# Altium project EVB-NORA-B2.PrjPcb (part 1 of 2)
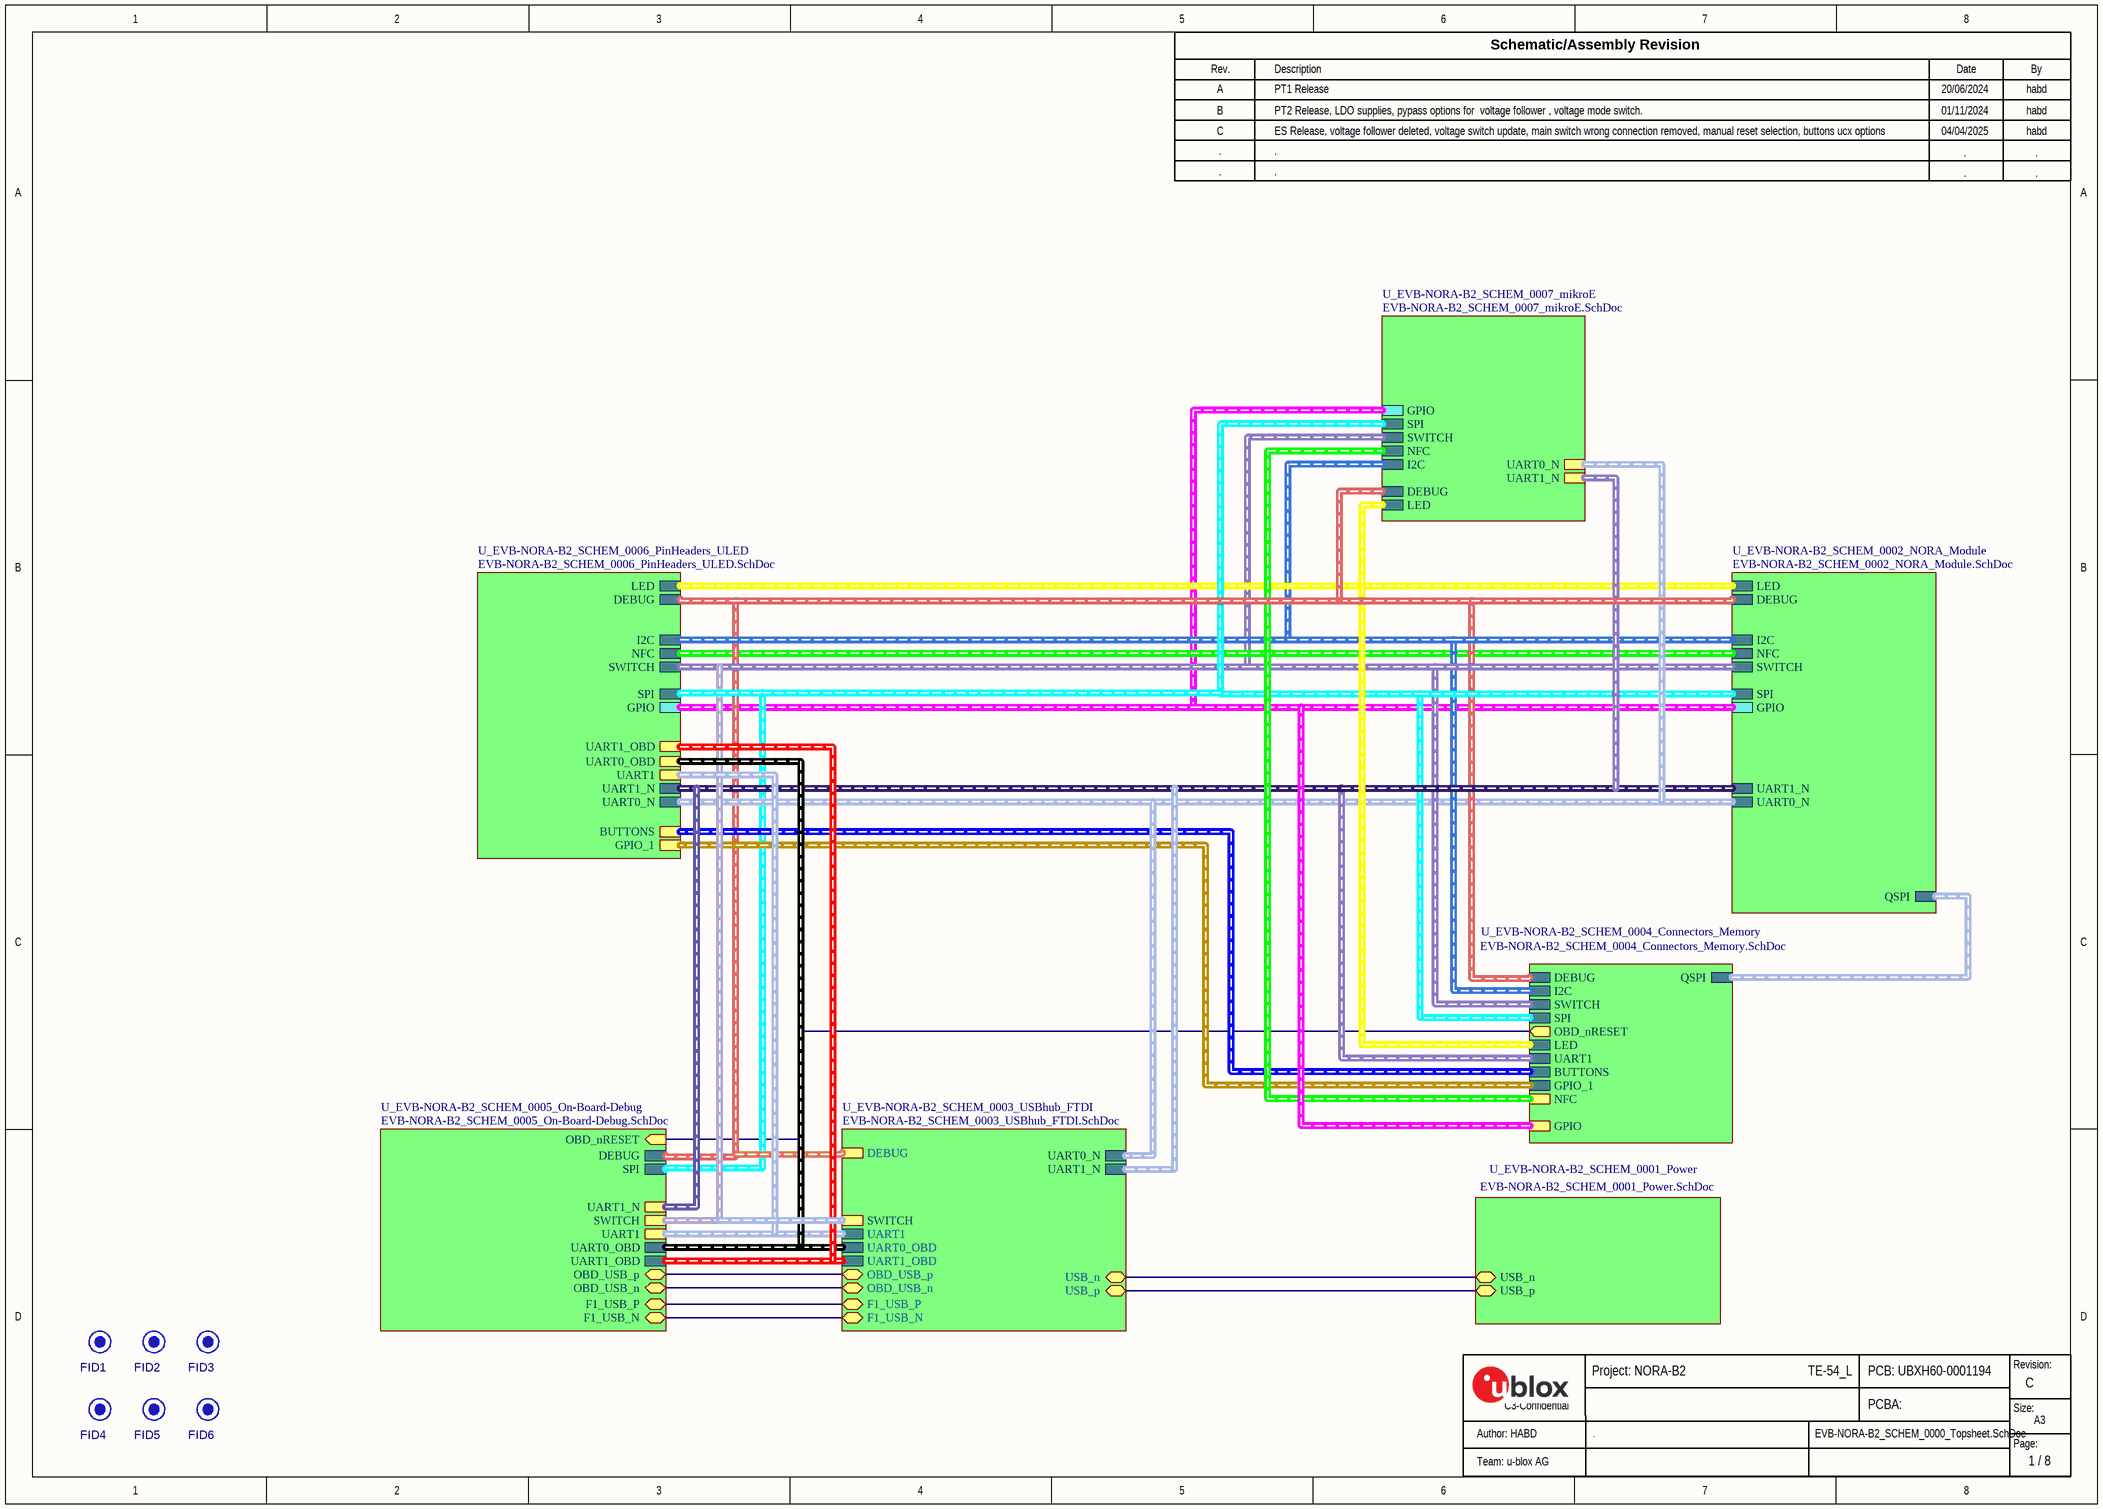
[diagram p0: EVB-NORA-B2_SCHEM_0000_Topsheet.SchDoc]
GlobalClientName: u-blox; GlobalProjectCode: TE-54_L; GlobalProjectLink: www.u-blox.com; GlobalProjectName: NORA-B2; GlobalProjectRevision: Rev C; GlobalProjectTeam: u-blox AG; GlobalReleaseDate: 04/04/2025; PCBConfidentialGrade: C3-Confidential; PCBDocNum: UBXH60-0001194; PCBName: EVK-NORA-B20; PCBRevRelease1: A; PCBRevReleaseBy1: habd; PCBRevReleaseBy2: habd; PCBRevReleaseBy3: habd; PCBRevReleaseBy4: -; PCBRevReleaseBy5: -; PCBRevReleaseDate1: 20/06/2024; PCBRevReleaseDate2: 01/11/2024; PCBRevReleaseDate3: 04/04/2025; PCBRevReleaseDate4: -; PCBRevReleaseDate5: -; PCBRevReleaseDesc1: PT1 Release; PCBRevReleaseDesc2: PT2 Release; PCBRevReleaseDesc3: ES Release; PCBRevReleaseDesc4: -; PCBRevReleaseDesc5: -; PCBRevReleaseRev1: A; PCBRevReleaseRev2: B; PCBRevReleaseRev3: C; PCBRevReleaseRev4: -; PCBRevReleaseRev5: -; PCBUBXNum: UBXH60-0001194; ProjectEngineer: HABD; ReleaseBy4: .; ReleaseBy4: .; ReleaseBy5: .; ReleaseBy5: .; ReleaseDate4: .; ReleaseDate5: .; ReleaseDesc4: .; ReleaseDesc5: .; ReleaseRev1: A; ReleaseRev2: B; ReleaseRev3: C; ReleaseRev4: .; ReleaseRev5: .; SchDocNum: EVK-NORA-B20_SCHEM; SchSheetTotal: 8; SheetSize: A3; VariantBy1: habd; VariantBy2: habd; VariantBy3: habd; VariantBy4: .; VariantBy5: .; VariantDate1: 20/06/2024; VariantDate2: 01/11/2024; VariantDate3: 04/04/2025; VariantDate4: .; VariantDate5: .; VariantDesc1: PT1 Release; VariantDesc2: PT2 Release, LDO supplies, pypass options for  voltage follower , voltage mode switch.; VariantDesc3: ES Release, voltage follower deleted, voltage switch update, main switch wrong connection removed, manual reset selection, buttons ucx options; VariantDesc4: .; VariantDesc5: .; VariantDescription: .; VariantRev: C; VariantRev1: A; VariantRev2: B; VariantRev3: C; VariantRev4: .; VariantRev5: .
4 sheets, 254 parts. Net scope: flat (ports and power ports of the same name join across sheets).
Board file: EVB-NORA-B20.PcbDoc
Sheets:
  EVB-NORA-B2_SCHEM_0000_Topsheet.SchDoc
    U_EVB-NORA-B2_SCHEM_0001_Power = EVB-NORA-B2_SCHEM_0001_Power.SchDoc
    U_EVB-NORA-B2_SCHEM_0002_NORA_Module = EVB-NORA-B2_SCHEM_0002_NORA_Module.SchDoc
    U_EVB-NORA-B2_SCHEM_0006_PinHeaders_ULED = EVB-NORA-B2_SCHEM_0006_PinHeaders_ULED.SchDoc

## Sheet EVB-NORA-B2_SCHEM_0000_Topsheet.SchDoc
size A3; Date: 7/24/2020; CompanyName: U-Blox; DrawnBy: EMOO; Engineer: EMOO; Organization: U-Blox; Address1: 3950 Fairview Industrial Dr SE #100; Address2: Salem, OR 97302; DocumentNumber: 1; SheetNumber: 1; SheetTotal: 8; SheetSize: B; SheetTitle: TopSheet

### Parts
FID1  FID  [FIDUCIAL40]  (value not drawn)  (no BOM)
FID2  FID  [FIDUCIAL40]  (value not drawn)  (no BOM)
FID3  FID  [FIDUCIAL40]  (value not drawn)  (no BOM)
FID4  FID  [FIDUCIAL40]  (value not drawn)  (no BOM)
FID5  FID  [FIDUCIAL40]  (value not drawn)  (no BOM)
FID6  FID  [FIDUCIAL40]  (value not drawn)  (no BOM)

### Sub-sheets
U_EVB-NORA-B2_SCHEM_0001_Power = EVB-NORA-B2_SCHEM_0001_Power.SchDoc: USB_n (bidir), USB_p (bidir)
U_EVB-NORA-B2_SCHEM_0002_NORA_Module = EVB-NORA-B2_SCHEM_0002_NORA_Module.SchDoc: LED (harness LED), DEBUG (harness Debug), UART1_N (harness UART1), I2C (harness I2C), NFC (harness NFC), SWITCH (harness SWITCH), UART0_N (harness UART0), QSPI (harness QSPI), SPI (harness SPI), GPIO (harness GPIO)
U_EVB-NORA-B2_SCHEM_0003_USBhub_FTDI = EVB-NORA-B2_SCHEM_0003_USBhub_FTDI.SchDoc (file not in this document): USB_n (bidir), USB_p (bidir), F1_USB_P (bidir), F1_USB_N (bidir), UART1 (harness UART-EXT), UART0_N (harness UART0), UART1_N (harness UART1), UART0_OBD (harness UART0_OBD), UART1_OBD (harness UART1_OBD), DEBUG (harness Debug), OBD_USB_n (bidir), OBD_USB_p (bidir), SWITCH (harness SWITCH)
U_EVB-NORA-B2_SCHEM_0004_Connectors_Memory = EVB-NORA-B2_SCHEM_0004_Connectors_Memory.SchDoc (file not in this document): DEBUG (harness Debug), I2C (harness I2C), SWITCH (harness SWITCH), QSPI (harness QSPI), SPI (harness SPI), LED (harness LED), UART1 (harness UART1), BUTTONS (harness BUTTONS), GPIO_1 (harness GP1O_1), OBD_nRESET (out), NFC (harness NFC), GPIO (harness GPIO)
U_EVB-NORA-B2_SCHEM_0005_On-Board-Debug = EVB-NORA-B2_SCHEM_0005_On-Board-Debug.SchDoc (file not in this document): F1_USB_P (bidir), F1_USB_N (bidir), UART0_OBD (harness UART0_OBD), UART1_OBD (harness UART1_OBD), DEBUG (harness Debug), SPI (harness SPI), OBD_nRESET (in), OBD_USB_p (bidir), OBD_USB_n (bidir), UART1 (harness UART1), SWITCH (harness SWITCH), UART1_N (harness UART1-NORA)
U_EVB-NORA-B2_SCHEM_0006_PinHeaders_ULED = EVB-NORA-B2_SCHEM_0006_PinHeaders_ULED.SchDoc: I2C (harness I2C), LED (harness LED), SWITCH (harness SWITCH), NFC (harness NFC), SPI (harness SPI), GPIO (harness GPIO), DEBUG (harness Debug), UART0_N (harness UART0), UART1_N (harness UART1), BUTTONS (harness BUTTONS), GPIO_1 (harness GP1O_1), UART1 (harness UART1), UART0_OBD (harness UART0_OBD), UART1_OBD (harness UART1_OBD)
U_EVB-NORA-B2_SCHEM_0007_mikroE = EVB-NORA-B2_SCHEM_0007_mikroE.SchDoc (file not in this document): I2C (harness I2C), LED (harness LED), SWITCH (harness SWITCH), NFC (harness NFC), DEBUG (harness Debug), SPI (harness SPI), GPIO (harness GPIO), UART0_N (harness UART0_NORA), UART1_N (harness UART1-NORA)

### Nets
(unnamed): sheet U_EVB-NORA-B2_SCHEM_0001_Power/USB_n, sheet U_EVB-NORA-B2_SCHEM_0003_USBhub_FTDI/USB_n
(unnamed): sheet U_EVB-NORA-B2_SCHEM_0001_Power/USB_p, sheet U_EVB-NORA-B2_SCHEM_0003_USBhub_FTDI/USB_p
(unnamed): sheet U_EVB-NORA-B2_SCHEM_0003_USBhub_FTDI/F1_USB_P, sheet U_EVB-NORA-B2_SCHEM_0005_On-Board-Debug/F1_USB_P
(unnamed): sheet U_EVB-NORA-B2_SCHEM_0003_USBhub_FTDI/F1_USB_N, sheet U_EVB-NORA-B2_SCHEM_0005_On-Board-Debug/F1_USB_N
(unnamed): sheet U_EVB-NORA-B2_SCHEM_0003_USBhub_FTDI/OBD_USB_n, sheet U_EVB-NORA-B2_SCHEM_0005_On-Board-Debug/OBD_USB_n
(unnamed): sheet U_EVB-NORA-B2_SCHEM_0003_USBhub_FTDI/OBD_USB_p, sheet U_EVB-NORA-B2_SCHEM_0005_On-Board-Debug/OBD_USB_p
(unnamed): sheet U_EVB-NORA-B2_SCHEM_0005_On-Board-Debug/OBD_nRESET, sheet U_EVB-NORA-B2_SCHEM_0004_Connectors_Memory/OBD_nRESET

### Buses and harness runs
harness sheet U_EVB-NORA-B2_SCHEM_0002_NORA_Module/DEBUG = sheet U_EVB-NORA-B2_SCHEM_0003_USBhub_FTDI/DEBUG = sheet U_EVB-NORA-B2_SCHEM_0004_Connectors_Memory/DEBUG = sheet U_EVB-NORA-B2_SCHEM_0005_On-Board-Debug/DEBUG = sheet U_EVB-NORA-B2_SCHEM_0006_PinHeaders_ULED/DEBUG = sheet U_EVB-NORA-B2_SCHEM_0007_mikroE/DEBUG
harness sheet U_EVB-NORA-B2_SCHEM_0002_NORA_Module/GPIO = sheet U_EVB-NORA-B2_SCHEM_0004_Connectors_Memory/GPIO = sheet U_EVB-NORA-B2_SCHEM_0006_PinHeaders_ULED/GPIO = sheet U_EVB-NORA-B2_SCHEM_0007_mikroE/GPIO
harness sheet U_EVB-NORA-B2_SCHEM_0002_NORA_Module/I2C = sheet U_EVB-NORA-B2_SCHEM_0004_Connectors_Memory/I2C = sheet U_EVB-NORA-B2_SCHEM_0006_PinHeaders_ULED/I2C = sheet U_EVB-NORA-B2_SCHEM_0007_mikroE/I2C
harness sheet U_EVB-NORA-B2_SCHEM_0002_NORA_Module/LED = sheet U_EVB-NORA-B2_SCHEM_0006_PinHeaders_ULED/LED
harness sheet U_EVB-NORA-B2_SCHEM_0002_NORA_Module/NFC = sheet U_EVB-NORA-B2_SCHEM_0006_PinHeaders_ULED/NFC
harness sheet U_EVB-NORA-B2_SCHEM_0002_NORA_Module/QSPI = sheet U_EVB-NORA-B2_SCHEM_0004_Connectors_Memory/QSPI
harness sheet U_EVB-NORA-B2_SCHEM_0002_NORA_Module/SPI = sheet U_EVB-NORA-B2_SCHEM_0004_Connectors_Memory/SPI = sheet U_EVB-NORA-B2_SCHEM_0005_On-Board-Debug/SPI = sheet U_EVB-NORA-B2_SCHEM_0006_PinHeaders_ULED/SPI = sheet U_EVB-NORA-B2_SCHEM_0007_mikroE/SPI
harness sheet U_EVB-NORA-B2_SCHEM_0002_NORA_Module/SWITCH = sheet U_EVB-NORA-B2_SCHEM_0003_USBhub_FTDI/SWITCH = sheet U_EVB-NORA-B2_SCHEM_0004_Connectors_Memory/SWITCH = sheet U_EVB-NORA-B2_SCHEM_0005_On-Board-Debug/SWITCH = sheet U_EVB-NORA-B2_SCHEM_0006_PinHeaders_ULED/SWITCH = sheet U_EVB-NORA-B2_SCHEM_0007_mikroE/SWITCH
harness sheet U_EVB-NORA-B2_SCHEM_0002_NORA_Module/UART0_N = sheet U_EVB-NORA-B2_SCHEM_0003_USBhub_FTDI/UART0_N = sheet U_EVB-NORA-B2_SCHEM_0006_PinHeaders_ULED/UART0_N = sheet U_EVB-NORA-B2_SCHEM_0007_mikroE/UART0_N
harness sheet U_EVB-NORA-B2_SCHEM_0002_NORA_Module/UART1_N = sheet U_EVB-NORA-B2_SCHEM_0003_USBhub_FTDI/UART1_N = sheet U_EVB-NORA-B2_SCHEM_0004_Connectors_Memory/UART1 = sheet U_EVB-NORA-B2_SCHEM_0005_On-Board-Debug/UART1_N = sheet U_EVB-NORA-B2_SCHEM_0006_PinHeaders_ULED/UART1_N = sheet U_EVB-NORA-B2_SCHEM_0007_mikroE/UART1_N
harness sheet U_EVB-NORA-B2_SCHEM_0003_USBhub_FTDI/UART0_OBD = sheet U_EVB-NORA-B2_SCHEM_0005_On-Board-Debug/UART0_OBD = sheet U_EVB-NORA-B2_SCHEM_0006_PinHeaders_ULED/UART0_OBD
harness sheet U_EVB-NORA-B2_SCHEM_0003_USBhub_FTDI/UART1 = sheet U_EVB-NORA-B2_SCHEM_0005_On-Board-Debug/UART1 = sheet U_EVB-NORA-B2_SCHEM_0006_PinHeaders_ULED/UART1
harness sheet U_EVB-NORA-B2_SCHEM_0003_USBhub_FTDI/UART1_OBD = sheet U_EVB-NORA-B2_SCHEM_0005_On-Board-Debug/UART1_OBD = sheet U_EVB-NORA-B2_SCHEM_0006_PinHeaders_ULED/UART1_OBD
harness sheet U_EVB-NORA-B2_SCHEM_0004_Connectors_Memory/BUTTONS = sheet U_EVB-NORA-B2_SCHEM_0006_PinHeaders_ULED/BUTTONS
harness sheet U_EVB-NORA-B2_SCHEM_0004_Connectors_Memory/GPIO_1 = sheet U_EVB-NORA-B2_SCHEM_0006_PinHeaders_ULED/GPIO_1
harness sheet U_EVB-NORA-B2_SCHEM_0004_Connectors_Memory/LED = sheet U_EVB-NORA-B2_SCHEM_0007_mikroE/LED
harness sheet U_EVB-NORA-B2_SCHEM_0004_Connectors_Memory/NFC = sheet U_EVB-NORA-B2_SCHEM_0007_mikroE/NFC

### Notes on the sheet
- Rev.
- Description
- Schematic/Assembly Revision
- Date
- By
- Revision:
- C3-Confidential
- Page:
- Size:
- A3

### Library data of the parts
FID1-FID6 = FIDUCIAL.04: Fiducial, 0.040" inner Dia, 0.075" outer Dia; Added By: Jeremy D; Part Number: FIDUCIAL.04; Size: 0.040"; Height: 0; DNP: DNP; Added Date: 2/1/2015; Checked By: Paul B; Checked Date: 2/5/2015

## Sheet EVB-NORA-B2_SCHEM_0001_Power.SchDoc
size A3; Date: 7/24/2020; CompanyName: U-blox; DrawnBy: EMOO; Engineer: EMOO; Organization: U-blox; Address1: 3950 Fairview Industrial Dr SE #100; Address2: Salem, OR 97302; DocumentNumber: 2; SheetNumber: 2; SheetTotal: 8; SheetSize: B; SheetTitle: Power
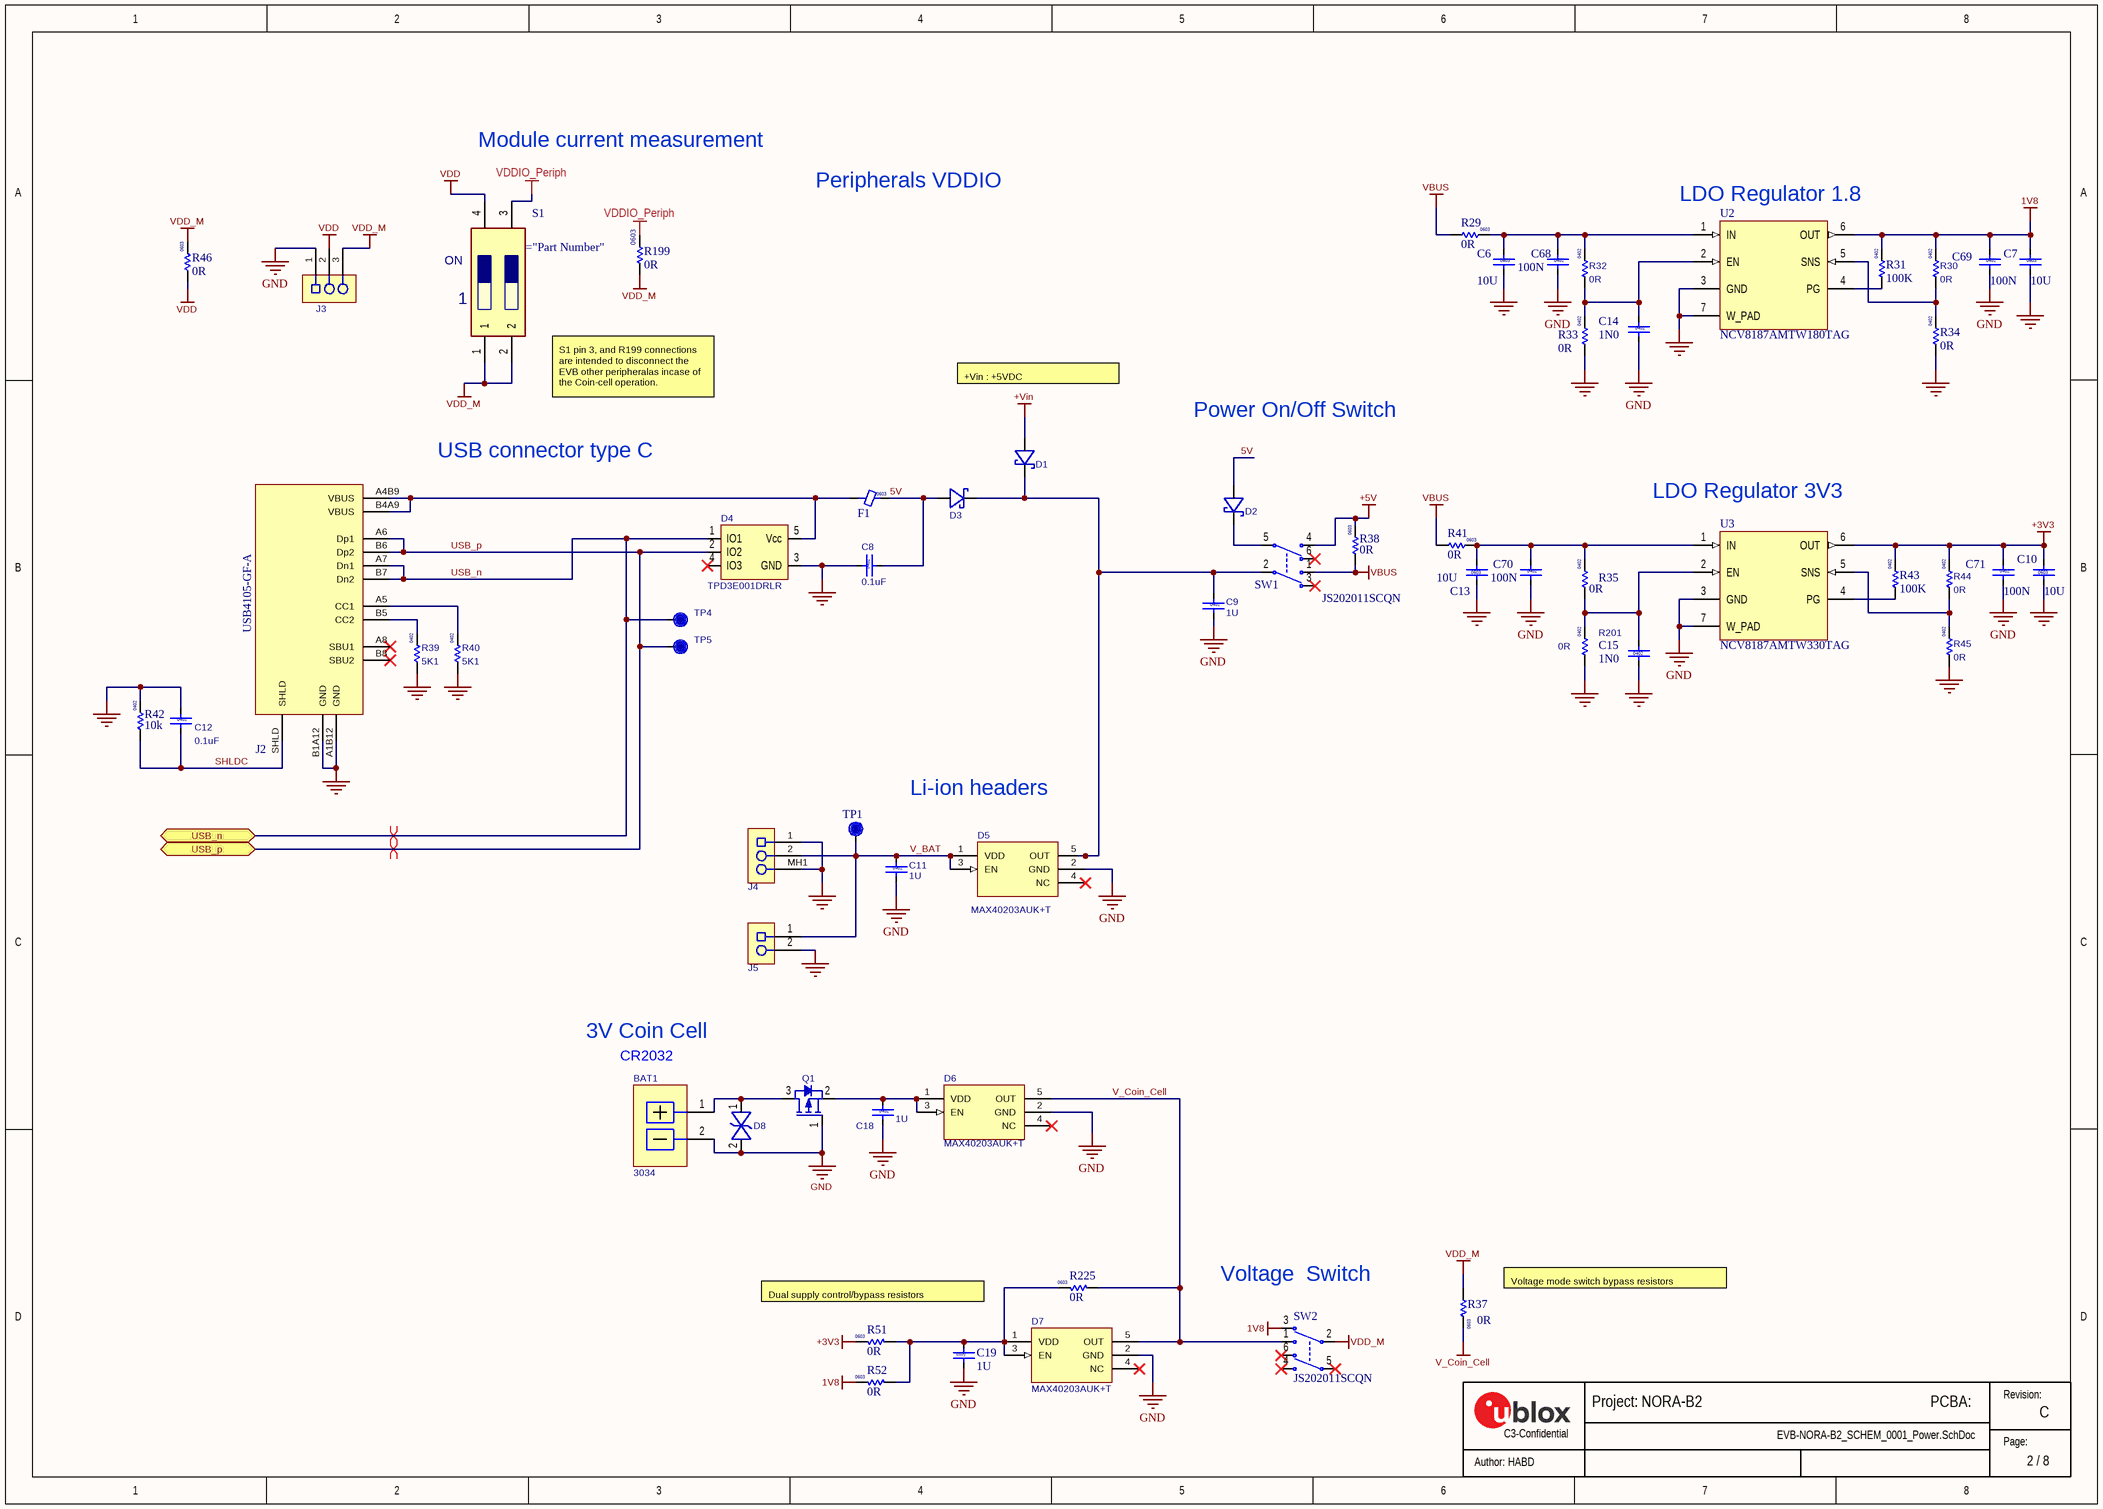
[diagram p1: EVB-NORA-B2_SCHEM_0001_Power.SchDoc]

### Parts
BAT1  UBXH03-0000009  [3034]  (value not drawn)
C6  value 10U  Size: 0603  [CAP_0603_1750Lx950Wx850H_600x1000Pad_900G_FLX]  (hidden comment: UBXH01-0000310)
C7  value 10U  Size: 0603  [CAP_0603_1750Lx950Wx850H_600x1000Pad_900G_FLX]  (hidden comment: UBXH01-0000310)
C8  value 0.1uF  Size: 0402  [Cap 0402 HD]  (hidden comment: 120-00016)
C9  value 1U  Size: 0402  [Cap 0402 HD]  (hidden comment: UBXH01-0000248)
C10  value 10U  Size: 0603  [CAP_0603_1750Lx950Wx850H_600x1000Pad_900G_FLX]  (hidden comment: UBXH01-0000310)
C11  value 1U  Size: 0402  [Cap 0402 HD]  (hidden comment: UBXH01-0000248)
C12  value 0.1uF  Size: 0402  [Cap 0402 HD]  (hidden comment: 120-00016)
C13  value 10U  Size: 0603  [CAP_0603_1750Lx950Wx850H_600x1000Pad_900G_FLX]  (hidden comment: UBXH01-0000310)
C14  value 1N0  Size: 0402  [Cap 0402 HD]  (hidden comment: UBXH01-0000013)
C15  value 1N0  Size: 0402  [Cap 0402 HD]  (hidden comment: UBXH01-0000013)
C18  value 1U  Size: 0402  [Cap 0402 HD]  (hidden comment: UBXH01-0000248)
C19  value 1U  Case/Package: 0x0y  [Cap 0402 HD]  (hidden comment: UBXH01-0000248)
C68  value 100N  Case/Package: 0402  (hidden comment: UBXH01-0000204)
C69  value 100N  Case/Package: 0402  (hidden comment: UBXH01-0000204)
C70  value 100N  Case/Package: 0402  (hidden comment: UBXH01-0000204)
C71  value 100N  Case/Package: 0402  (hidden comment: UBXH01-0000204)
D1  110-00005  [SOD-123F_U]  (value not drawn)
D2  110-00005  [SOD-123F_U]  (value not drawn)
D3  110-00005  [SOD-123F_U]  (value not drawn)
D4  Manufacturer P/N: TPD3E001DRLR  [SOT-553]  (hidden comment: 110-00018)
D5  Manufacturer Part Number 1: MAX40203AUK+T  [SOT-23-5_2]  (hidden comment: UBXH12-0000539)
D6  Manufacturer Part Number 1: MAX40203AUK+T  [SOT-23-5_2]  (hidden comment: UBXH12-0000539)
D7  Manufacturer Part Number 1: MAX40203AUK+T  [SOT-23-5_2]  (hidden comment: UBXH12-0000539)
D8  UBXH07-0000034  [SOD-923]  (value not drawn)
F1  Size: 0603  [IND_0603_1750Lx950Wx1050H_600x800Pad_800G_FLX]  (hidden comment: UBXH08-0000001)
J2  value USB4105-GF-A  [USB4105-GF-A]  (hidden comment: UBXH04-0000785)
J3  UBXH04-0000792  [HDR-0.1P-3Pin-1Row-SMT]  (value not drawn)
J4  UBXH04-0000791  [B2B-PH-SM4-TB]  (value not drawn)
J5  UBXH04-0000026  [HDR-0.1P-2PIN-TH]  (value not drawn)
Q1  140-00005  [SOT-723]  (value not drawn)
R29  value 0R  Size: 0603  [RES_0603_1700Lx950Wx600H_600x1000Pad_800G_FLX]  (hidden comment: UBXH18-0003001)
R30  value 0R  Size: 0402  [RES 0402 HD]  (hidden comment: UBXH18-0003002)
R31  value 100K  Size: 0402  [RES 0402 HD]  (hidden comment: UBXH18-0000005)
R32  value 0R  Size: 0402  [RES 0402 HD]  (hidden comment: UBXH18-0003002)
R33  value 0R  Size: 0402  [RES 0402 HD]  (hidden comment: UBXH18-0003002)
R34  value 0R  Size: 0402  [RES 0402 HD]  (hidden comment: UBXH18-0003002)
R35  value 0R  Size: 0402  [RES 0402 HD]  (hidden comment: UBXH18-0003002)
R37  value 0R  Size: 0603  [RES_0603_1700Lx950Wx600H_600x1000Pad_800G_FLX]  (hidden comment: UBXH18-0003001)
R38  value 0R  Size: 0603  [RES_0603_1700Lx950Wx600H_600x1000Pad_800G_FLX]  (hidden comment: UBXH18-0003001)
R39  value 5K1  Size: 0402  [RES 0402 HD]  (hidden comment: UBXH18-0008066)
R40  value 5K1  Size: 0402  [RES 0402 HD]  (hidden comment: UBXH18-0008066)
R41  value 0R  Size: 0603  [RES_0603_1700Lx950Wx600H_600x1000Pad_800G_FLX]  (hidden comment: UBXH18-0003001)
R42  value 10k  Size: 0402  [RES 0402 HD]  (hidden comment: 180-00024)
R43  value 100K  Size: 0402  [RES 0402 HD]  (hidden comment: UBXH18-0000005)
R44  value 0R  Size: 0402  [RES 0402 HD]  (hidden comment: UBXH18-0003002)
R45  value 0R  Size: 0402  [RES 0402 HD]  (hidden comment: UBXH18-0003002)
R46  value 0R  Size: 0603  [RES_0603_1700Lx950Wx600H_600x1000Pad_800G_FLX]  (hidden comment: UBXH18-0003001)
R51  value 0R  Size: 0603  [RES_0603_1700Lx950Wx600H_600x1000Pad_800G_FLX]  (hidden comment: UBXH18-0003001)
R52  value 0R  Size: 0603  [RES_0603_1700Lx950Wx600H_600x1000Pad_800G_FLX]  (hidden comment: UBXH18-0003001)
R199  value 0R  Size: 0603  [RES_0603_1700Lx950Wx600H_600x1000Pad_800G_FLX]  (hidden comment: UBXH18-0003001)
R201  value 0R  Size: 0402  [RES 0402 HD]  (hidden comment: UBXH18-0003002)
R225  value 0R  Size: 0603  [RES_0603_1700Lx950Wx600H_600x1000Pad_800G_FLX]  (hidden comment: UBXH18-0003001)
S1  (no value)  [2182LPSTJ]
SW1  Manufacturer P/N: JS202011SCQN  [SW_Slide_DPDT_JS202011SCQN]  (hidden comment: UBXH19-0000050)
SW2  Manufacturer P/N: JS202011SCQN  [SW_Slide_DPDT_JS202011SCQN]  (hidden comment: UBXH19-0000050)
TP1  TP10R  [TP10R]  (value not drawn)
TP4  TP10R  [TP10R]  (value not drawn)  (no BOM)
TP5  TP10R  [TP10R]  (value not drawn)  (no BOM)
U2  Manufacturer Part Number 1: NCV8187AMTW180TAG  [DFN0.65P-6Pin_W-Pad]  (hidden comment: UBXH43-0000004)
U3  Manufacturer Part Number 1: NCV8187AMTW330TAG  [DFN0.65P-6Pin_W-Pad]  (hidden comment: UBXH43-0000003)

### Ports
USB_n (bidir), USB_p (bidir)

### Nets
1V8: C7.1 C69.1 R30.2 R31.2 R52.2 SW2.3(N.C-1) U2.6(OUT)
+3V3: C10.1 C71.1 R43.2 R44.2 R51.2 U3.6(OUT)
+5V: R38.2 SW1.4(N.O-2)
+Vin: D1.A(Anode)
GND: BAT1.2 C6.2 C7.2 C8.1 C9.2 C10.2 C11.2 C12.1 C13.2 C14.2 C15.1 C18.2 C19.2 C68.2 C69.2 C70.2 C71.2 D4.3(GND) D5.2(GND) D6.2(GND) D7.2(GND) D8.2 J2.A1B12(GND) J2.B1A12(GND) J3.1 J4.1 J4.MH1 J5.2 Q1.1(G) R33.1 R34.1 R39.1 R40.1 R42.2 R45.1 R201.1 U2.3(GND) U2.7(W_PAD) U3.3(GND) U3.7(W_PAD)
V_Coin_Cell: D6.5(OUT) D7.5(OUT) R37.2 R225.1 SW2.1(N.O-1)
VBUS: R29.1 R38.1 R41.1 SW1.1(N.O-1)
VDD: J3.2 R46.1 S1.4
VDD_M: J3.3 R37.1 R46.2 R199.1 S1.1 S1.2 SW2.2(COM-1)
VDDIO_Periph: R199.2 S1.3
5V: C8.2 D2.A(Anode) D3.A(Anode) F1.2
SHLDC: C12.2 J2.SHLD R42.1
USB_n: D4.1(IO1) J2.A7(Dn1) J2.B7(Dn2) TP4.1 ; port USB_n
USB_p: D4.2(IO2) J2.A6(Dp1) J2.B6(Dp2) TP5.1 ; port USB_p
V_BAT: C11.1 D5.1(VDD) D5.3(EN) J4.2 J5.1 TP1.1
NetBAT1_1: BAT1.1 D8.1 Q1.3(D)
NetC6_1: C6.1 C68.1 R29.2 R32.2 U2.1(IN)
NetC9_1: C9.1 D1.C(Cathode) D3.C(Cathode) D5.5(OUT) SW1.2(COM-1)
NetC13_1: C13.1 C70.1 R35.2 R41.2 U3.1(IN)
NetC14_1: C14.1 R32.1 R33.2 U2.2(EN)
NetC15_2: C15.2 R35.1 R201.2 U3.2(EN)
NetC18_1: C18.1 D6.1(VDD) D6.3(EN) Q1.2(S)
NetC19_1: C19.1 D7.1(VDD) D7.3(EN) R51.1 R52.1 R225.2
NetD2_C: D2.C(Cathode) SW1.5(COM-2)
NetD4_5: D4.5(Vcc) F1.1 J2.A4B9(VBUS) J2.B4A9(VBUS)
NetJ2_A5: J2.A5(CC1) R40.2
NetJ2_B5: J2.B5(CC2) R39.2
NetR30_1: R30.1 R34.2 U2.5(SNS)
NetR31_1: R31.1 U2.4(PG)
NetR43_1: R43.1 U3.4(PG)
NetR44_1: R44.1 R45.2 U3.5(SNS)

Not connected (* = marked no-connect by the designer): D4 4(IO3)*; D5 4(NC)*; D6 4(NC)*; D7 4(NC)*; J2 A8(SBU1)* B8(SBU2)*; SW1 3(N.C-1)* 6(N.C-2)*; SW2 4(N.O-2)* 5(COM-2)* 6(N.C-2)*

### Layout directives
differential pair: USB_n, USB_p

### Notes on the sheet
- Module current measurement
- (near R199) Peripherals VDDIO
- (near U2) LDO Regulator 1.8
- +Vin : +5VDC
- (near S1) S1 pin 3, and R199 connections are intended to disconnect the EVB other peripheralas incase of the Coin-cell operation.
- Power On/Off Switch
- (near J2) USB connector type C
- (near U3) LDO Regulator 3V3
- Li-ion headers
- 3V Coin Cell
- (near BAT1) CR2032
- Dual supply control/bypass resistors
- (near SW2) Voltage  Switch
- (near R37) Voltage mode switch bypass resistors
- Revision:
- C3-Confidential
- Page:
- (in symbol 218-2LPSTJ) ON

### Library data of the parts
BAT1 = UBXH03-0000009: BATTERY HOLDER COIN SMT CR2020 CR2025 CR2032 KEYSTONE 3034; Manufacturer: Keystone Electronics Corporation; Value: 3034; Editor: eric.moog; Env: ROHS; Permitted Use: Support Products; Perferred: PREF; Mfg P/N Status: Active; Mfg P/N Split: 100; Mfg P/N Released: No; Manufacturer P/N: 3034; Part Number: UBXH03-0000009; Min Operating Temp: -55°C; Max Operating Temp: 125°C; Part Type: Battery; UBX Wiki: https://wiki.u-blox.com/bin/view/Operations/PartDetails?index=38836; RefDes: BT; Mfg P/N Datasheet: https://wiki.u-blox.com/bin/view/Generic/Docs/DocumentSummary?index=38835
C6 C7 C10 C13 = UBXH01-0000310: CAP CER X7R 0603 10U 20% 10V; Manufacturer: Murata Manufacturing Company, Ltd.; Manufacturer P/N: GRM188Z71A106MA73; Editor: michael.hein; Released by: martin.grasse; Env: ROHS; Permitted Use: Volume Products; Perferred: PREF; Mfg P/N Status: Active; Mfg P/N Split: 100; Mfg P/N Released: Yes; Part Number: UBXH01-0000310; Tolerance: 20%; Max Voltage: 10V; Min Operating Temp: -55°C; Max Operating Temp: 125°C; Part Type: Capacitor; Release Data: 2017-02-09T11:14:05; UBX Wiki: https://wiki.u-blox.com/bin/view/Operations/PartDetails?index=26280; RefDes: C; Mfg P/N Datasheet: https://wiki.u-blox.com/bin/view/Generic/Docs/DocumentSummary?index=26282; Manufacturer 2: Murata Manufacturing Company, Ltd.; Manufacturer P/N 2: GRM188Z71A106KA73; Mfg P/N Status 2: Active; Mfg P/N Split 2: 0; Mfg P/N Released 2: Yes; Mfg P/N Datasheet 2: https://wiki.u-blox.com/bin/view/Generic/Docs/DocumentSummary?index=28416
  C10 C13: Case/Package: 0x0y
C8 C12 = 120-00016: Cap, Ceramic 0.1uF 10V 10% X5R 0402; Part Name: CAP CER 0.1UF 10V 10% X5R 0402; Part_Type: Ceramic Capacitor; Manufacturer: Murata Electronics North America; Manufacturer P/N: GRM155R61A104KA01J; Item_Phase: Production; Component Mounting Type: SMT; Tolerance: +/- 10%; Use in new designs: Yes; Part Number: 120-00016; Revision: 0A; Supplier 1: Digi-Key; Supplier Part Number 1: 490-6297-1-ND; Manufacturer 2: Yageo; Manufacturer P/N 2: CC0402KRX5R6BB104; Supplier 2: Digi-Key; Supplier Part Number 2: 311-1336-1-ND; Arena Link: https://app.bom.com/a/GYHPV2L2L43KRMBK?v=spec.summary; Height: 0.55mm; Pins: 2; Temperature Coefficient: X5R; Voltage: 10V
C9 C11 C18 C19 = UBXH01-0000248: CAP CER X5R 0402 1U 10% 10V; Manufacturer: Murata Manufacturing Company, Ltd.; Manufacturer P/N: GRM155R61C105KA12; Editor: michael.hein; Released by: igor.shevchenko; Env: ROHS; Permitted Use: Volume Products; Perferred: PREF; Mfg P/N Status: Active; Mfg P/N Split: 100; Mfg P/N Released: Yes; Part Number: UBXH01-0000248; Tolerance: 10%; Max Voltage: 10V; Min Operating Temp: -40°C; Max Operating Temp: 85°C; Part Type: Capacitor; Release Data: 2016-03-16T11:26:35; UBX Wiki: https://wiki.u-blox.com/bin/view/Operations/PartDetails?index=24378; RefDes: C; Mfg P/N Datasheet: https://wiki.u-blox.com/bin/view/Generic/Docs/DocumentSummary?index=29581; Manufacturer 2: TDK Corporation; Manufacturer P/N 2: C1005X5R1E105K050BC; Mfg P/N Status 2: Active; Mfg P/N Split 2: 0; Mfg P/N Released 2: Yes; Mfg P/N Datasheet 2: https://wiki.u-blox.com/bin/view/Generic/Docs/DocumentSummary?index=28058; Manufacturer 3: Samsung Electro-Mechanics; Manufacturer P/N 3: CL05A105KA5NQNC; Mfg P/N Status 3: Active; Mfg P/N Split 3: 0; Mfg P/N Released 3: Yes; Mfg P/N Datasheet 3: https://wiki.u-blox.com/bin/view/Generic/Docs/DocumentSummary?index=28056
  C19: Size: 0402
C14 C15 = UBXH01-0000013: CAP CER X7R 0402 1N0 10% 50V; Manufacturer: Murata Manufacturing Company, Ltd.; Manufacturer P/N: GRM155R71H102KA01; Editor: massimo.vlacci; Released by: dario.antonaz; Env: ROHS; Permitted Use: Volume Products; Perferred: PREF; Mfg P/N Status: NRND; Mfg P/N Split: 100; Mfg P/N Released: Yes; Part Number: UBXH01-0000013; Tolerance: 10%; Max Voltage: 50V; Part Type: Capacitor; Release Data: 2015-04-23T14:26:43; UBX Wiki: https://wiki.u-blox.com/bin/view/Operations/PartDetails?index=8466; RefDes: C; Mfg P/N Datasheet: https://wiki.u-blox.com/bin/view/Generic/Docs/DocumentSummary?index=22572; Case/Package: 0x0y
C68-C71 = UBXH01-0000204: CAP CER X5R 0402 100N 10% 50V; Manufacturer 1: Murata Manufacturing Company, Ltd.; Manufacturer Part Number 1: GRM155R61H104KE14D; Manufacturer Split 1: 100; Part Phase: Limited Production; Part Revision: A; Environmental Grade: RoHS; Owner: Matej Budin; Use in new designs: Yes; Volume Use: No; Part Number: UBXH01-0000204; Automotive: No; ComponentLink1Description: Arena Link; ComponentLink1Url: https://app.bom.com/2K4NSGOQKM5DWAAY9GZM; Maximum Voltage: 50V; Part Name: CAP CER X5R 0402 100N 10% 50V; Part Status: Preferred; Part Type: Ceramic Capacitor; Release Date: 2024-06-17T04:48:12Z; Temp Coef: X5R; Tolerance: 10%
D1-D3 = 110-00005: Diode, Schottky, 20V 1A SOD-123F, 340mV Vf @ 1A / MBR120VLSFT3G; Manufacturer 1: ON Semiconductor; Part Name: Diode Schottky 20V 1A SOD-123FL; Body Size: None; Item Phase: In Production; MFG Package: SOD-123FL; Use in new designs: Yes; Part Number: 110-00005; Manufacturer Part Number 1: MBR120VLSFT3G; Supplier 1: Digi-Key; Supplier Part Number 1: MBR120VLSFT3GOSCT-ND; Manufacturer 2: None; Manufacturer Part Number 2: None; Supplier 2: None; Supplier Part Number 2: None; Current: 1A; Height: 0.98mm; Max Operating Temp: 125; Min Operating Temp: -65; Pins: 2; Revision: 0B; Voltage: 20V; UBX Code: None
D4 = 110-00018: LOW-CAPACITANCE 3-CHANNEL ESD-PROTECTION ARRAY; Part Name: TVS Diode, 3CH High Speed ESD; Part_Type: Diode; Manufacturer: Texas Instruments; Item_Phase: Production; Body Size: 1.6mm x 1.2mm; Component Mounting Type: SMT; Diode Type: TVS; Use in new designs: Yes; Voltage: 5V; Part Number: 110-00018; Revision: 0A; Supplier 1: Digi-Key; Supplier Part Number 1: 296-21885-1-ND; Arena Link: https://app.bom.com/a/UCV39GZGZIHX50AE?v=spec.summary; Height: .55mm; MFG Package: SOT-553; Package Type: SOT; Pins: 5
D5-D7 = UBXH12-0000539: IDEAL DIODE OR CONTROLLER SOURCE SELECTOR SWITCH P-CHANNEL 1:1 SOT-23-5 5.5V 1A; Part Name: IC IDEAL DIODE LDO 1.2-5.5V 1.0A SOT-23-5; Manufacturer 1: Maxim; Item_Phase: Preliminary; Body Size: 2.8mm x 2.9mm; Component Mounting Type: SMT; Current: 1.0A; SMT Pitch: 0.95mm; Use in new designs: Yes; Value: MAX40203AUK+T; Editor: eric.moog; Env: ROHS; Permitted Use: Support Products; Mfg P/N Status: Active; Mfg P/N Split: 100; Mfg P/N Released: No; Part Number: UBXH12-0000539; Part_Type: Ideal Diode; Supplier 1: Digi-Key; Supplier Part Number 1: 175-MAX40203AUK+TTR-ND; Height: 1.25; MFG Package: SOT-23-5; Package Type: SOT-23-5; Pins: 5; Voltage: 5.5V; HelpURL: https://datasheets.maximintegrated.com/en/ds/MAX40203.pdf; Max Voltage: 5.5V; Max Current: 1A; Part Type: PMIC; UBX Wiki: https://wiki.u-blox.com/bin/view/Operations/PartDetails?index=38597; Perferred: N/A; RefDes: U; Manufacturer: Maxim; Manufacturer P/N: MAX40203AUK+T; Mfg P/N Datasheet: https://wiki.u-blox.com/bin/view/Generic/Docs/DocumentSummary?index=38598
D8 = UBXH07-0000034: ESD PROTECTION DIODE ULTRA LOW LEAKAGE SOD923 ON SEMI 3V3; Manufacturer: ON Semiconductor; Manufacturer P/N: ESD9R3.3ST5G; Editor: pierpaolo.arban; Released by: dario.antonaz; Env: ROHS; Permitted Use: Support Products; Perferred: PREF; Mfg P/N Status: Active; Mfg P/N Split: 100; Mfg P/N Released: Yes; Part Number: UBXH07-0000034; Value: 3V3; Part Type: Diode; Release Data: 2015-04-23T14:51:11; UBX Wiki: https://wiki.u-blox.com/bin/view/Operations/PartDetails?index=22447; RefDes: D; Mfg P/N Datasheet: https://wiki.u-blox.com/bin/view/Generic/Docs/DocumentSummary?index=22449
F1 = UBXH08-0000001: FERRITE BEAD 0603 600 OHM AT 100MHZ 600OHM 500mA; Manufacturer: TDK Corporation; Manufacturer P/N: MMZ1608B601C; Editor: daniel.hurni; Released by: martin.frauchiger; Env: ROHS; Permitted Use: Support Products; Perferred: PREF; Mfg P/N Status: Active; Mfg P/N Split: 100; Mfg P/N Released: Yes; Part Number: UBXH08-0000001; Value: 600OHM; Max Current: 500mA; Min Operating Temp: -40°C; Max Operating Temp: 125°C; Part Type: Ferrite; Release Data: 2009-12-02T10:18:36; UBX Wiki: https://wiki.u-blox.com/bin/view/Operations/PartDetails?index=7960; RefDes: FB; Mfg P/N Datasheet: https://wiki.u-blox.com/bin/view/Generic/Docs/DocumentSummary?index=7941
J2 = UBXH04-0000785: CONN RCP USB2.0 TYP C 24P SMD RA 20V 6.25A; Manufacturer 1: GCT; Body Size: 7.3mm x 8.9mm; Item Phase: Unreleased; SMT Pitch: 0.5mm; Use in new designs: Yes; Voltage: <20V DC; UBX Code: None; Editor: eric.moog; Env: ROHS; Permitted Use: Support Products; Perferred: PREF; Mfg P/N Status: Active; Mfg P/N Split: 100; Mfg P/N Released: No; Part Number: UBXH04-0000785; Manufacturer Part Number 1: USB4105-GF-A; Height: 3.31mm; Max Operating Temp: 85°C; Min Operating Temp: -40°C; Pins: 8; Revision: None; Size: Other; Manufacturer 2: None; Manufacturer Part Number 2: None; Supplier 2: None; Supplier Part Number 2: None; Max Voltage: 20V; Max Current: 6.25A; Part Type: Connector; UBX Wiki: https://wiki.u-blox.com/bin/view/Operations/PartDetails?index=38207; RefDes: J; Manufacturer: GCT; Manufacturer P/N: USB4105-GF-A; Mfg P/N Datasheet: https://wiki.u-blox.com/bin/view/Generic/Docs/DocumentSummary?index=38208
J3 = UBXH04-0000792: 1-ROW SMD CONN 100MIL GRID 3 -PIN 100V 3A; Manufacturer P/N: M20-8770342; Manufacturer: HARWiN; Value: M20-8770342; Editor: eric.moog; Env: ROHS; Permitted Use: Support Products; Mfg P/N Status: Active; Mfg P/N Split: 100; Mfg P/N Released: No; Part Number: UBXH04-0000792; Max Voltage: 100V; Max Current: 3A; Min Operating Temp: -40°C; Max Operating Temp: 105°C; Part Type: Connector; UBX Wiki: https://wiki.u-blox.com/bin/view/Operations/PartDetails?index=38569; Perferred: N/A; RefDes: J; Mfg P/N Datasheet: https://wiki.u-blox.com/bin/view/Generic/Docs/DocumentSummary?index=28457
J4 = UBXH04-0000791: CONN 1-ROW SMT 2.0MM GRID 2-PIN VERT 100V 2A; Part Name: Conn, SMT, 0.079" Pitch, 2 Pin, Vert, Black; Manufacturer: JST; Item Phase: In Production; Use in new designs: Yes; Voltage: None; Value: B2B-PH-SM4-TB; Editor: eric.moog; Env: ROHS; Permitted Use: Support Products; Mfg P/N Status: Active; Mfg P/N Split: 100; Mfg P/N Released: No; Part Number: UBXH04-0000791; Manufacturer Part Number 1: B2B-PH-SM4-TB; Supplier 1: None; Supplier Part Number 1: None; Diameter: None; Height: 6.5mm; Max Operating Temp: 85°C; Min Operating Temp: -30°C; Pins: 2; Revision: 0A; UBX Code: None; Manufacturer 2: None; Manufacturer Part Number 2: None; Supplier 2: None; Supplier Part Number 2: None; Manufacturer P/N: B2B-PH-SM4-TB; Max Voltage: 100V; Max Current: 2A; Part Type: Connector; UBX Wiki: https://wiki.u-blox.com/bin/view/Operations/PartDetails?index=38567; Perferred: N/A; RefDes: J; Mfg P/N Datasheet: https://wiki.u-blox.com/bin/view/Generic/Docs/DocumentSummary?index=35463
J5 = UBXH04-0000026: 1-ROW TH-PCB SOCKETS 100MIL GRID 2-PIN 0.64MM SQUARE POLARIZE; Manufacturer P/N: M20-9990245; Manufacturer: HARWiN; Value: M20-9990245; Editor: roland.rust; Released by: alvaro.nussbaum; Env: ROHS; Permitted Use: Internal Use; Perferred: PREF; Mfg P/N Status: Active; Mfg P/N Split: 100; Mfg P/N Released: Yes; Part Number: UBXH04-0000026; Part Type: Connector; Release Data: 2015-06-04T16:45:09; UBX Wiki: https://wiki.u-blox.com/bin/view/Operations/PartDetails?index=10937; RefDes: J
Q1 = 140-00005: P-MOSFET, 20V, 100mA, SOT-723-3; Part Name: MOSFET P-CH 20V 0.1A VMT3; Manufacturer 1: Rohm Semiconductor; Manufacturer Part Number 1: RZM001P02T2L; Body Size: 1.2mm x 0.8mm; Transistor Type: P-Channel; Use in new designs: Yes; Item Phase: In Production; Thermal Pad: No; UBX Code: None; Part Number: 140-00005; Current: 100mA; Height: 0.5mm; MFG Package: SOT-723; Pins: 3; Voltage: 20V; Max Operating Temp: 150; Min Operating Temp: -55; Revision: 0B; Manufacturer 2: Toshiba Semiconductor and Storage; Supplier 1: Digi-Key; Supplier Part Number 1: RZM001P02T2LCT-ND; Manufacturer Part Number 2: SSM3J35MFV,L3F; Supplier 2: Digi-Key; Supplier Part Number 2: SSM3J35MFVL3FCT-ND
R29 R37 R38 R41 R46 R51 R52 R199 R225 = UBXH18-0003001: RES THICK FILM CHIP 0603 0R 0 100mW; Manufacturer: YAGEO; Manufacturer P/N: RC0603JR-070RL; Tolerance: 0; Editor: martin.frauchiger; Env: ROHS; Permitted Use: Volume Products; Perferred: PREF; Mfg P/N Status: Active; Mfg P/N Split: 100; Mfg P/N Released: Yes; Part Number: UBXH18-0003001; Max Power: 100mW; Part Type: Resistor; Released by: martin.frauchiger; Release Data: 2005-07-14T10:55:51; UBX Wiki: https://wiki.u-blox.com/bin/view/Operations/PartDetails?index=6609; RefDes: R
  R199: Case/Package: 0x0y
R30 R32 R44 R45 R201 = UBXH18-0003002: RES THICK FILM CHIP 0402 0R 0 100mW; Manufacturer: KOA; Manufacturer P/N: RK73Z1ETTP; Tolerance: 0; Editor: charlotte.biber; Released by: peter.mueller; Env: ROHS; Permitted Use: Volume Products; Perferred: PREF; Mfg P/N Status: NRND; Mfg P/N Split: 100; Mfg P/N Released: Yes; Part Number: UBXH18-0003002; Max Power: 100mW; Part Type: Resistor; Release Data: 2012-06-05 09:49:55.978616; UBX Wiki: https://wiki.u-blox.com/bin/view/Operations/PartDetails?index=6611; RefDes: R; Manufacturer 2: YAGEO; Manufacturer P/N 2: 2322_705_91001_L; Mfg P/N Status 2: NRND; Mfg P/N Split 2: 0; Mfg P/N Released 2: Yes
R31 R43 = UBXH18-0000005: RES THICK FILM CHIP 0402 100K 1% 63mW; Manufacturer: KOA; Manufacturer P/N: RK73H1ETTP1003F; Editor: dario.antonaz; Released by: sandro.sestan; Env: ROHS; Permitted Use: Volume Products; Mfg P/N Status: Active; Mfg P/N Split: 100; Mfg P/N Released: Yes; Part Number: UBXH18-0000005; Tolerance: 1%; Max Power: 63mW; Part Type: Resistor; Release Data: 2009-11-30T11:05:22; UBX Wiki: https://wiki.u-blox.com/bin/view/Operations/PartDetails?index=8114; Perferred: N/A; RefDes: R; Mfg P/N Split 2: 0; Mfg P/N Released 2: Yes; Mfg P/N Datasheet: https://wiki.u-blox.com/bin/view/Generic/Docs/DocumentSummary?index=8222
  R31: Manufacturer 2: YAGEO; Manufacturer P/N 2: RC0402FR-07100KL; Mfg P/N Status 2: Active; Case/Package: 0x0y; Mfg P/N Datasheet 2: https://wiki.u-blox.com/bin/view/Generic/Docs/DocumentSummary?index=29373; Manufacturer 3: ROHM; Manufacturer P/N 3: MCR01MZPF1003; Mfg P/N Status 3: Obsolete; Mfg P/N Split 3: 0; Mfg P/N Released 3: Yes; Mfg P/N Datasheet 3: https://wiki.u-blox.com/bin/view/Generic/Docs/DocumentSummary?index=8186
  R43: Manufacturer 2: ROHM; Manufacturer P/N 2: MCR01MZPF1003; Mfg P/N Status 2: Obsolete; Mfg P/N Datasheet 2: https://wiki.u-blox.com/bin/view/Generic/Docs/DocumentSummary?index=8186
R33-R35 = UBXH18-0003002: RES THICK FILM CHIP 0402 0R 0 100mW; Manufacturer: KOA; Manufacturer P/N: RK73Z1ETTD; Tolerance: 0; Editor: charlotte.biber; Released by: peter.mueller; Env: ROHS; Permitted Use: Volume Products; Perferred: PREF; Mfg P/N Status: NRND; Mfg P/N Split: 100; Mfg P/N Released: Yes; Part Number: UBXH18-0003002; Max Power: 100mW; Part Type: Resistor; Release Data: 2012-06-05T09:49:55; UBX Wiki: https://wiki.u-blox.com/bin/view/Operations/PartDetails?index=6611; RefDes: R; Manufacturer 2: YAGEO; Manufacturer P/N 2: 2322_705_91001_L; Mfg P/N Status 2: Obsolete; Mfg P/N Split 2: 0; Mfg P/N Released 2: Yes
R39 R40 = UBXH18-0008066: RES THICK FILM CHIP 0402 5K1 5% 100mW; Manufacturer: Panasonic; Manufacturer P/N: ERJ-2GEJ512X; Editor: alvaro.nussbaum; Released by: roland.rust; Env: ROHS; Permitted Use: Internal Use; Perferred: NONPREF; Mfg P/N Status: Active; Mfg P/N Split: 100; Mfg P/N Released: No; Part Number: UBXH18-0008066; Tolerance: 5%; Max Power: 100mW; Part Type: Resistor; Release Data: 2016-02-11T15:22:01; UBX Wiki: https://wiki.u-blox.com/bin/view/Operations/PartDetails?index=6972; RefDes: R
R42 = 180-00024: Resistor 10k ohm 1% 1/16W, 0402; Part Name: RES SMD 10K OHM 1% 1/16W 0402; Manufacturer 1: Samsung Electro-Mechanics America, Inc; Manufacturer Part Number 1: RC1005F103CS; Tolerance: +/- 1%; Use in new designs: Yes; Item Phase: In Production; UBX Code: None; Part Number: 180-00024; Revision: 0E; Supplier 1: Digi-Key; Supplier Part Number 1: 1276-3431-1-ND; Manufacturer 2: Hong Kong Resistors Manufactory; Height: 0.4mm; Pins: 2; Power: 1/16W; Voltage: N/A; Manufacturer Part Number 2: RCT0210KFLF; Supplier 2: None; Supplier Part Number 2: None; Max Operating Temp: 155; Min Operating Temp: -55
S1 = 218-2LPSTJ: Switch; Manufacturer_Name: CTS; Datasheet Link: https://www.ctscorp.com/wp-content/uploads/218.pdf; Height: 2.7mm; Manufacturer_Part_Number: 218-2LPSTJ; Mouser Part Number: 774-2182LPSTJ; Mouser Price/Stock: https://www.mouser.co.uk/ProductDetail/CTS-Electronic-Components/218-2LPSTJ?qs=qNzHFtQhdJ8h31nbRNBSWA%3D%3D; Arrow Part Number: 218-2LPSTJ; Arrow Price/Stock: https://www.arrow.com/en/products/218-2lpstj/cts
SW1 SW2 = UBXH19-0000050: 2 WAY ON-ON SUB-MINIATURE SLIDE SWITCH SMD JS SERIES; Manufacturer: C&K Components; Value: JS202011SCQN; Editor: andre.pick; Released by: martin.pilik; Env: ROHS; Permitted Use: Support Products; Perferred: PREF; Mfg P/N Status: Active; Mfg P/N Split: 100; Mfg P/N Released: Yes; Part Number: UBXH19-0000050; Min Operating Temp: -40°C; Max Operating Temp: 85°C; Part Type: Switch; Release Data: 2022-06-09T16:59:15; UBX Wiki: https://wiki.u-blox.com/bin/view/Operations/PartDetails?index=36899; RefDes: S; Mfg P/N Datasheet: https://wiki.u-blox.com/bin/view/Generic/Docs/DocumentSummary?index=16625
TP1 TP4 TP5 = TP10R: Testpoint, Round 1.0mm Dia; Added By: Jeremy D; Part Number: TP10R; Size: 1.0mm; Height: 0; DNP: DNP; Checked By: Paul B
  TP1: Added Date: 2015-02-01; Checked Date: 2015-02-05
  TP4 TP5: Added Date: 2/1/2015; Checked Date: 2/5/2015
U2 = UBXH43-0000004: LDO REGULATOR 1.8V,LOW Iq, WDFNW6 2x2 MM PACKAGE 1200 mA; Manufacturer 1: ONSEMI Conductor; Manufacturer Split 1: 100; Part Phase: Unreleased; Environmental Grade: RoHS; Owner: Hozaifa Abdelgadir; Use in new designs: Yes; Volume Use: No; Maximum Current: 1.2A; Body Size: 2.10mm x 2.10 mm; Max Supply Voltage: 5.5V; Min Supply Voltage: 1.5; SMT Pitch: 0.65mm; Part Number: UBXH43-0000004; Automotive: No; ComponentLink1Description: Arena Link; ComponentLink1Url: https://app.bom.com/1J3MRFNPJL4CV8H3H3XG; Max Operating Temp: 150°C; Min Operating Temp: -40°C; Part Name: LDO REGULATOR 1.8V,LOW Iq, WDFNW6 2x2 MM PACKAGE 1200 mA; Part Status: Non-Preferred; Part Type: Regulator - Linear; Height: 0.8mm; Mounting Type: SMT; Output Voltage: 1.8V; Pins: 6; Single Source: No; Case/Package: WDFNW6 2x2; Thermal Pad: Yes
U3 = UBXH43-0000003: LDO REGULATOR 3.3V,LOW Iq, WDFNW6 2x2 MM, 0.65P PACKAGE 1200 mA; Manufacturer 1: ONSEMI Conductor; Manufacturer Split 1: 100; Part Name: LDO REGULATOR  3.3V,LOW Iq, WDFNW6 2x2 MM PACKAGE 1200 mA; Part Phase: Unreleased; Part Revision: 1; Environmental Grade: RoHS; Owner: Hozaifa Abdelgadir; Use in new designs: Yes; Volume Use: No; Maximum Current: 1.2A; Body Size: 2.1mmx2.1mm; Max Supply Voltage: 5.5V; Min Supply Voltage: 1.5V; SMT Pitch: 0.65mm; Part Number: UBXH43-0000003; Automotive: No; ComponentLink1Description: Arena Link; ComponentLink1Url: https://app.bom.com/R9TCH5DF9BU2LY72VT52; Max Operating Temp: 150°C; Min Operating Temp: -40°C; Part Status: Non-Preferred; Part Type: Regulator - Linear; Height: 0.8mm; Mounting Type: SMT; Output Voltage: 3.3V; Pins: 6; Single Source: No; Case/Package: WDFNW6 2x2; Thermal Pad: Yes

## Sheet EVB-NORA-B2_SCHEM_0002_NORA_Module.SchDoc: UBX_NORA_B1_SCHEM_0001_NORA_B1_Module
size A3; Date: 7/24/2020; CompanyName: U-blox; DrawnBy: EMOO; Engineer: EMOO; Organization: U-blox; Address1: 3950 Fairview Industrial Dr SE #100; Address2: Salem, OR 97302; DocumentNumber: 3; SheetNumber: 3; SheetTotal: 8; Website: www.u-blox.com; SheetSize: B
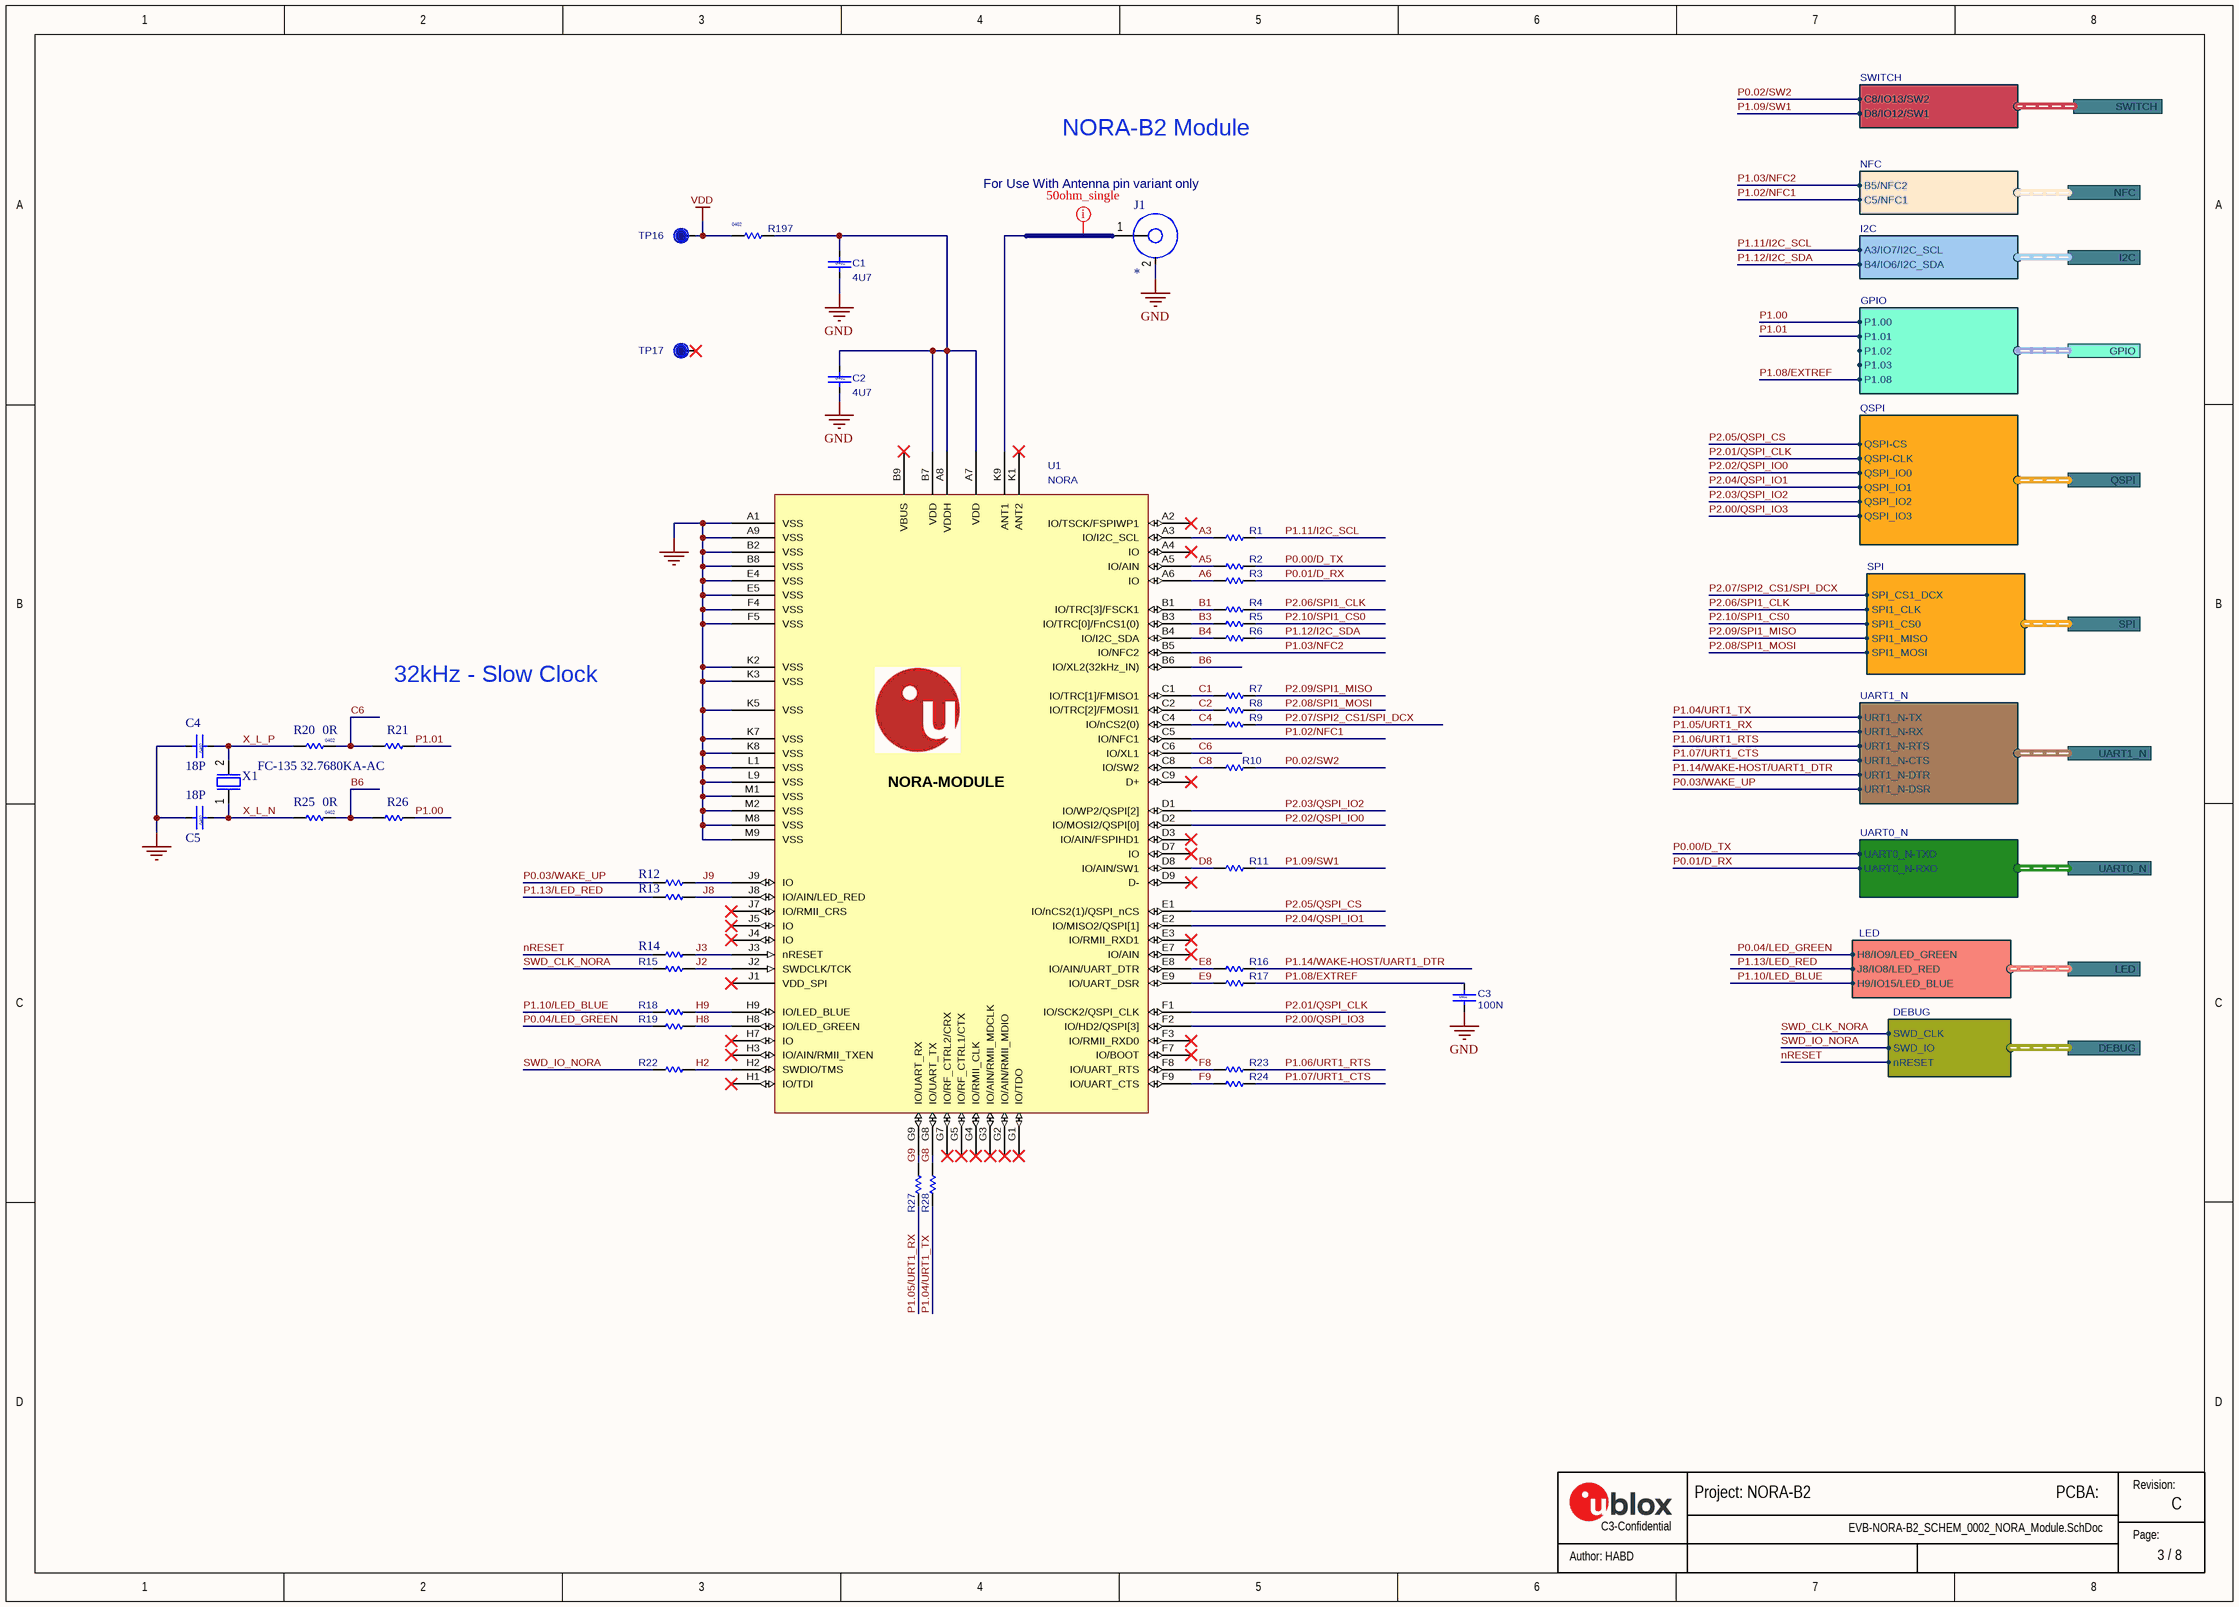
[diagram p2: EVB-NORA-B2_SCHEM_0002_NORA_Module.SchDoc]

### Parts
C1  value 4U7  Size: 0402  [Cap 0402 HD]  (hidden comment: UBXH01-0000243)
C2  value 4U7  Size: 0402  [Cap 0402 HD]  (hidden comment: UBXH01-0000243)
C3  value 100N  Size: 0402  [Cap 0402 HD]  (hidden comment: UBXH01-2021002)
C4  value 18P  Size: 0402  [Cap_0402_1100Lx600Wx600H_600x600Pad_350G_FLX]  (hidden comment: UBXH01-0004017)
C5  value 18P  Size: 0402  [Cap_0402_1100Lx600Wx600H_600x600Pad_350G_FLX]  (hidden comment: UBXH01-0004017)
J1  130-00067  [U.FL_3Pin]  (value not drawn)
R1  UBXH18-0003002  [RES 0402 HD]  (value not drawn)
R2  UBXH18-0003002  [RES 0402 HD]  (value not drawn)
R3  UBXH18-0003002  [RES 0402 HD]  (value not drawn)
R4  UBXH18-0003002  [RES 0402 HD]  (value not drawn)
R5  UBXH18-0003002  [RES 0402 HD]  (value not drawn)
R6  UBXH18-0003002  [RES 0402 HD]  (value not drawn)
R7  UBXH18-0003002  [RES 0402 HD]  (value not drawn)
R8  UBXH18-0003002  [RES 0402 HD]  (value not drawn)
R9  UBXH18-0003002  [RES 0402 HD]  (value not drawn)
R10  UBXH18-0003002  [RES 0402 HD]  (value not drawn)
R11  UBXH18-0003002  [RES 0402 HD]  (value not drawn)
R12  UBXH18-0003002  [RES_0402_1100Lx600Wx400H_500x600Pad_400G_FLX]  (value not drawn)
R13  UBXH18-0003002  [RES_0402_1100Lx600Wx400H_500x600Pad_400G_FLX]  (value not drawn)
R14  UBXH18-0003002  [RES_0402_1100Lx600Wx400H_500x600Pad_400G_FLX]  (value not drawn)
R15  UBXH18-0003002  [RES 0402 HD]  (value not drawn)
R16  UBXH18-0003002  [RES 0402 HD]  (value not drawn)
R17  UBXH18-0003002  [RES 0402 HD]  (value not drawn)
R18  UBXH18-0003002  [RES 0402 HD]  (value not drawn)
R19  UBXH18-0003002  [RES 0402 HD]  (value not drawn)
R20  value 0R  Size: 0402  [RES 0402 HD]  (hidden comment: UBXH18-0003002)
R21  UBXH18-0003002  [RES_0402_1100Lx600Wx400H_500x600Pad_400G_FLX]  (value not drawn)
R22  UBXH18-0003002  [RES 0402 HD]  (value not drawn)
R23  UBXH18-0003002  [RES 0402 HD]  (value not drawn)
R24  UBXH18-0003002  [RES 0402 HD]  (value not drawn)
R25  value 0R  Size: 0402  [RES 0402 HD]  (hidden comment: UBXH18-0003002)
R26  UBXH18-0003002  [RES_0402_1100Lx600Wx400H_500x600Pad_400G_FLX]  (value not drawn)
R27  UBXH18-0003002  [RES 0402 HD]  (value not drawn)
R28  UBXH18-0003002  [RES 0402 HD]  (value not drawn)
R197  Size: 0402  [RES 0402 HD]  (hidden comment: UBXH18-0003002)
TP16  TP10R  [TP10R]  (value not drawn)  (no BOM)
TP17  TP10R  [TP10R]  (value not drawn)  (no BOM)
U1  NORA  [NORA_LGA82R_1430X1040X180_ANT]
X1  Manufacturer P/N: FC-135 32.7680KA-AC  [XTAL_3215]  (hidden comment: UBXH21-0008104)

### Ports
DEBUG (harness Debug), GPIO (harness GPIO), I2C (harness I2C), LED (harness LED), NFC (harness NFC), QSPI (harness QSPI), SPI (harness SPI), SWITCH (harness SWITCH), UART0_N (harness UART0_N), UART1_N (harness UART1_N)

### Harnesses
DEBUG: nRESET, SWD_IO, SWD_CLK
UART1_N: URT1_N-RTS, URT1_N-CTS, URT1_N-TX, URT1_N-RX, URT1_N-DTR, URT1_N-DSR
QSPI: QSPI-CS, QSPI-CLK, QSPI_IO0, QSPI_IO1, QSPI_IO2, QSPI_IO3
LED: H9/IO15/LED_BLUE, J8/IO8/LED_RED, H8/IO9/LED_GREEN
I2C: A3/IO7/I2C_SCL, B4/IO6/I2C_SDA
NFC: B5/NFC2, C5/NFC1
SWITCH: C8/IO13/SW2, D8/IO12/SW1
GPIO: P1.00, P1.01, P1.02, P1.08, P1.03
UART0_N: UART0_N-TXD, UART0_N-RXD
SPI: SPI_CS1_DCX, SPI1_CLK, SPI1_CS0, SPI1_MISO, SPI1_MOSI

### Nets
GND: C1.2 C2.2 C3.1 C4.2 C5.2 J1.2 U1.A1(VSS) U1.A9(VSS) U1.B2(VSS) U1.B8(VSS) U1.E4(VSS) U1.E5(VSS) U1.F4(VSS) U1.F5(VSS) U1.K2(VSS) U1.K3(VSS) U1.K5(VSS) U1.K7(VSS) U1.K8(VSS) U1.L1(VSS) U1.L9(VSS) U1.M1(VSS) U1.M2(VSS) U1.M8(VSS) U1.M9(VSS)
VDD: R197.2 TP16.1
A3: R1.2 U1.A3(IO/I2C_SCL)
A5: R2.2 U1.A5(IO/AIN)
A6: R3.2 U1.A6(IO)
B1: R4.2 U1.B1(IO/TRC[3]/FSCK1)
B3: R5.2 U1.B3(IO/TRC[0]/FnCS1(0))
B4: R6.2 U1.B4(IO/I2C_SDA)
B6: R25.2 R26.2 U1.B6(IO/XL2(32kHz_IN))
C1: R7.2 U1.C1(IO/TRC[1]/FMISO1)
C2: R8.2 U1.C2(IO/TRC[2]/FMOSI1)
C4: R9.2 U1.C4(IO/nCS2(0))
C6: R20.2 R21.2 U1.C6(IO/XL1)
C8: R10.2 U1.C8(IO/SW2)
D8: R11.2 U1.D8(IO/AIN/SW1)
E8: R16.2 U1.E8(IO/AIN/UART_DTR)
E9: R17.2 U1.E9(IO/UART_DSR)
F8: R23.2 U1.F8(IO/UART_RTS)
F9: R24.2 U1.F9(IO/UART_CTS)
G8: R28.1 U1.G8(IO/UART_TX)
G9: R27.1 U1.G9(IO/UART_RX)
H2: R22.1 U1.H2(SWDIO/TMS)
H8: R19.1 U1.H8(IO/LED_GREEN)
H9: R18.1 U1.H9(IO/LED_BLUE)
J2: R15.1 U1.J2(SWDCLK/TCK)
J3: R14.1 U1.J3(nRESET)
J8: R13.1 U1.J8(IO/AIN/LED_RED)
J9: R12.1 U1.J9(IO)
nRESET: R14.2 ; port DEBUG.nRESET
P0.00/D_TX: R2.1 ; port UART0_N.UART0_N-TXD
P0.01/D_RX: R3.1 ; port UART0_N.UART0_N-RXD
P0.02/SW2: R10.1 ; port SWITCH.C8/IO13/SW2
P0.03/WAKE_UP: R12.2 ; port UART1_N.URT1_N-DSR
P0.04/LED_GREEN: R19.2 ; port LED.H8/IO9/LED_GREEN
P1.00: R26.1 ; port GPIO.P1.00
P1.01: R21.1 ; port GPIO.P1.01
P1.02/NFC1: U1.C5(IO/NFC1) ; port NFC.C5/NFC1
P1.03/NFC2: U1.B5(IO/NFC2) ; port NFC.B5/NFC2
P1.04/URT1_TX: R28.2 ; port UART1_N.URT1_N-TX
P1.05/URT1_RX: R27.2 ; port UART1_N.URT1_N-RX
P1.06/URT1_RTS: R23.1 ; port UART1_N.URT1_N-RTS
P1.07/URT1_CTS: R24.1 ; port UART1_N.URT1_N-CTS
P1.08/EXTREF: C3.2 R17.1 ; port GPIO.P1.08
P1.09/SW1: R11.1 ; port SWITCH.D8/IO12/SW1
P1.10/LED_BLUE: R18.2 ; port LED.H9/IO15/LED_BLUE
P1.11/I2C_SCL: R1.1 ; port I2C.A3/IO7/I2C_SCL
P1.12/I2C_SDA: R6.1 ; port I2C.B4/IO6/I2C_SDA
P1.13/LED_RED: R13.2 ; port LED.J8/IO8/LED_RED
P1.14/WAKE-HOST/UART1_DTR: R16.1 ; port UART1_N.URT1_N-DTR
P2.00/QSPI_IO3: U1.F2(IO/HD2/QSPI[3]) ; port QSPI.QSPI_IO3
P2.01/QSPI_CLK: U1.F1(IO/SCK2/QSPI_CLK) ; port QSPI.QSPI-CLK
P2.02/QSPI_IO0: U1.D2(IO/MOSI2/QSPI[0]) ; port QSPI.QSPI_IO0
P2.03/QSPI_IO2: U1.D1(IO/WP2/QSPI[2]) ; port QSPI.QSPI_IO2
P2.04/QSPI_IO1: U1.E2(IO/MISO2/QSPI[1]) ; port QSPI.QSPI_IO1
P2.05/QSPI_CS: U1.E1(IO/nCS2(1)/QSPI_nCS) ; port QSPI.QSPI-CS
P2.06/SPI1_CLK: R4.1 ; port SPI.SPI1_CLK
P2.07/SPI2_CS1/SPI_DCX: R9.1 ; port SPI.SPI_CS1_DCX
P2.08/SPI1_MOSI: R8.1 ; port SPI.SPI1_MOSI
P2.09/SPI1_MISO: R7.1 ; port SPI.SPI1_MISO
P2.10/SPI1_CS0: R5.1 ; port SPI.SPI1_CS0
SWD_CLK_NORA: R15.2 ; port DEBUG.SWD_CLK
SWD_IO_NORA: R22.2 ; port DEBUG.SWD_IO
X_L_N: C5.1 R25.1 X1.1
X_L_P: C4.1 R20.1 X1.2
NetC1_1: C1.1 C2.1 R197.1 U1.A7(VDD) U1.A8(VDDH) U1.B7(VDD)
NetJ1_1: J1.1(ANT) U1.K9(ANT1)

Not connected (* = marked no-connect by the designer): TP17 1*; U1 A2(IO/TSCK/FSPIWP1)* A4(IO)* B9(VBUS)* C9(D+)* D3(IO/AIN/FSPIHD1)* D7(IO)* D9(D-)* E3(IO/RMII_RXD1)* E7(IO/AIN)* F3(IO/RMII_RXD0)* F7(IO/BOOT)* G1(IO/TDO)* G2(IO/AIN/RMII_MDIO)* G3(IO/AIN/RMII_MDCLK)* G4(IO/RMII_CLK)* G5(IO/RF_CTRL1/CTX)* G7(IO/RF_CTRL2/CRX)* H1(IO/TDI)* H3(IO/AIN/RMII_TXEN)* H7(IO)* J1(VDD_SPI)* J4(IO)* J5(IO)* J7(IO/RMII_CRS)* K1(ANT2)*

### Layout directives
net class 50_ohm_se: NetJ1_1

### Notes on the sheet
- (near J1) For Use With Antenna pin variant only
- NORA-B2 Module
- 32kHz - Slow Clock
- Revision:
- C3-Confidential
- Page:
- (in symbol NORA-MODULE_ALT) NORA-MODULE

### Library data of the parts
C1 C2 = UBXH01-0000243: CAP CER X5R 0402 4U7 20% 10V; Manufacturer: Murata Manufacturing Company, Ltd.; Manufacturer P/N: GRM155R61A475MEAA; Editor: martin.pilik; Released by: fabrice.bret-dibat; Env: GREEN; Permitted Use: Volume Products; Perferred: PREF; Mfg P/N Status: Active; Mfg P/N Split: 100; Mfg P/N Released: Yes; Part Number: UBXH01-0000243; Tolerance: 20%; Max Voltage: 10V; Min Operating Temp: -40°C; Max Operating Temp: 85°C; Part Type: Capacitor; Release Data: 2021-05-10 12:57:47.325652; UBX Wiki: https://wiki.u-blox.com/bin/view/Operations/PartDetails?index=24303; RefDes: C; Mfg P/N Datasheet: https://wiki.u-blox.com/bin/view/Generic/Docs/DocumentSummary?index=24302
C3 = UBXH01-2021002: CAP CER X5R 0402 100N 10% 10V; Manufacturer: Murata Manufacturing Company, Ltd.; Manufacturer P/N: GRM155R61A104KA01; Editor: roland.rust; Env: GREEN; Permitted Use: Volume Products; Perferred: PREF; Mfg P/N Status: NRND; Mfg P/N Split: 100; Mfg P/N Released: Yes; Part Number: UBXH01-2021002; Tolerance: 10%; Max Voltage: 10V; Part Type: Capacitor; Released by: roland.rust; Release Data: 2005-07-22T13:59:44; UBX Wiki: https://wiki.u-blox.com/bin/view/Operations/PartDetails?index=5759; RefDes: C; Manufacturer 2: Samsung Electro-Mechanics; Manufacturer P/N 2: CL05A104KP5NNN; Mfg P/N Status 2: Active; Mfg P/N Split 2: 0; Mfg P/N Released 2: Yes; Mfg P/N Datasheet 2: https://wiki.u-blox.com/bin/view/Generic/Docs/DocumentSummary?index=28113
C4 C5 = UBXH01-0004017: CAP CER C0G 0402 18P 5% 25V; Manufacturer: Murata Manufacturing Company, Ltd.; Manufacturer P/N: GRM1555C1H180JA01; Editor: doris.zahnd; Env: ROHS; Permitted Use: Volume Products; Perferred: PREF; Mfg P/N Status: NRND; Mfg P/N Split: 100; Mfg P/N Released: Yes; Released by: daniel.hurni; Part Number: UBXH01-0004017; Tolerance: 5%; Max Voltage: 25V; Min Operating Temp: -55°C; Max Operating Temp: 125°C; Part Type: Capacitor; UBX Wiki: https://wiki.u-blox.com/bin/view/Operations/PartDetails?index=5178; RefDes: C; Release Data: 2009-12-03T17:48:42; Manufacturer 2: Murata Manufacturing Company, Ltd.; Manufacturer P/N 2: GRM1555C1E180JZ01; Mfg P/N Status 2: Obsolete; Mfg P/N Split 2: 0; Mfg P/N Released 2: Yes; Manufacturer 3: Murata Manufacturing Company, Ltd.; Manufacturer P/N 3: GRM1555C1H180JZ01; Mfg P/N Status 3: Obsolete; Mfg P/N Split 3: 0; Mfg P/N Released 3: Yes
J1 = 130-00067: U.FL jack, SMA 50 ohm, 3 pin, SMT; Part Name: CON RF UMC U.FL Jack 3Pin SMT; Manufacturer 1: Hirose Electric Co Ltd; Manufacturer Part Number 1: U.FL-R-SMT(10); Use in new designs: Yes; UBX Code: UBXH04-0001026; Voltage: None; Item Phase: In Production; Manufacturer P/N: *; Part Number: 130-00067; Revision: 0A; Supplier 1: Digi-Key; Supplier Part Number 1: H9161CT-ND; Manufacturer 2: Dongguan Qintai Electronics Co, Ltd.; Supplier 2: Rayson Technology co., ltd; Supplier Part Number 2: MHF-RT-1; Height: 1.25mm; Pins: 3; Max Operating Temp: 90; Diameter: None; Min Operating Temp: -40; Manufacturer Part Number 2: MHF-RT-1
R1-R11 R15-R19 R22-R24 R27 R28 R197 = UBXH18-0003002: as R30 on sheet EVB-NORA-B2_SCHEM_0001_Power; Value: 0R; Part Number: UBXH18-0003002; Max Power: 100mW; Part Type: Resistor; Release Data: 2012-06-05 09:49:55.978616; UBX Wiki: https://wiki.u-blox.com/bin/view/Operations/PartDetails?index=6611; RefDes: R; Manufacturer 2: YAGEO; Manufacturer P/N 2: 2322_705_91001_L; Mfg P/N Status 2: NRND; Mfg P/N Split 2: 0; Mfg P/N Released 2: Yes
  R1-R11 R15-R19 R22-R24 R27 R28: Size: 0402
R12-R14 R20 R21 R25 R26 = UBXH18-0003002: as R33 on sheet EVB-NORA-B2_SCHEM_0001_Power; Part Number: UBXH18-0003002; Part Type: Resistor; UBX Wiki: https://wiki.u-blox.com/bin/view/Operations/PartDetails?index=6611; RefDes: R; Manufacturer 2: YAGEO; Manufacturer P/N 2: 2322_705_91001_L; Mfg P/N Split 2: 0; Mfg P/N Released 2: Yes; Max Power: 100mW
  R12-R14 R21 R26: Value: 0R; Size: 0402; Release Data: 2012-06-05T09:49:55; Mfg P/N Status 2: Obsolete
  R20 R25: Release Data: 2012-06-05 09:49:55.978616; Mfg P/N Status 2: NRND
TP16 TP17 = TP10R: as TP1 on sheet EVB-NORA-B2_SCHEM_0001_Power; Part Number: TP10R; Size: 1.0mm; Height: 0; DNP: DNP; Added Date: 2/1/2015; Checked By: Paul B; Checked Date: 2/5/2015
U1 = NORA-MODULE_ALT: u-blox NORA module generic symbol for use within module designs - alternate version; Part Description: NORA MODULE FOOTPRINT; Body Size: 14.3 mm x 10.4 mm; Manufacturer P/N: NORA; Part Number: NORA; Part Name: NORA; Part_Type: Module; Manufacturer: u-blox; Height: 0; Value: NORA
X1 = UBXH21-0008104: CRYSTAL CL=9PF EPSON FC-135 NI/SN TERMINATION 32.768KHz; Part Phase: Unreleased; Use in new designs: No; Environmental Grade: RoHS; Frequency Tolerance: 20PPM; Owner: Andreas Thiel; Volume Use: Yes; Part Number: UBXH21-0008104; Part Name: CRYSTAL CL=9PF EPSON FC-135 NI/SN TERMINATION; Automotive: No; ComponentLink1Description: Arena Link; ComponentLink1URL: https://app.bom.com/6O8RWKSUOQ9H0EE2EEBI; Frequency: 32.768KHz; Part Status: Non-Preferred; Part Type: Crystal